# Altium schematic sheet 51.VO-HDMI2.0 TX(DP to HDMI).SchDoc
size 420 x 297 mm; Revision: V2.1; Schematic Page Number: 11; Page Number: 29; Check: Default; Schematic Name: RK_NVR_DEMO1_RK3588_LP4/4x_V21; Page Count: 43; Page name: 51.VO-HDMI2.0 TX(DP to HDMI); Designer: Zhangdz; Schematic Page Count: 99; Revcode: V2.1; DsnPath: E:\Work\SBER\RK3588_SOM\temp\RK_NVR_DEMO1_RK3588_LP4XD200P232SD8_V21_20211228.DSN; SchematicName: RK_NVR_DEMO1_RK3588_LP4/4x_V21; PageName: 51.VO-HDMI2.0 TX(DP to HDMI); PageSize: A3; TopSchematic: True
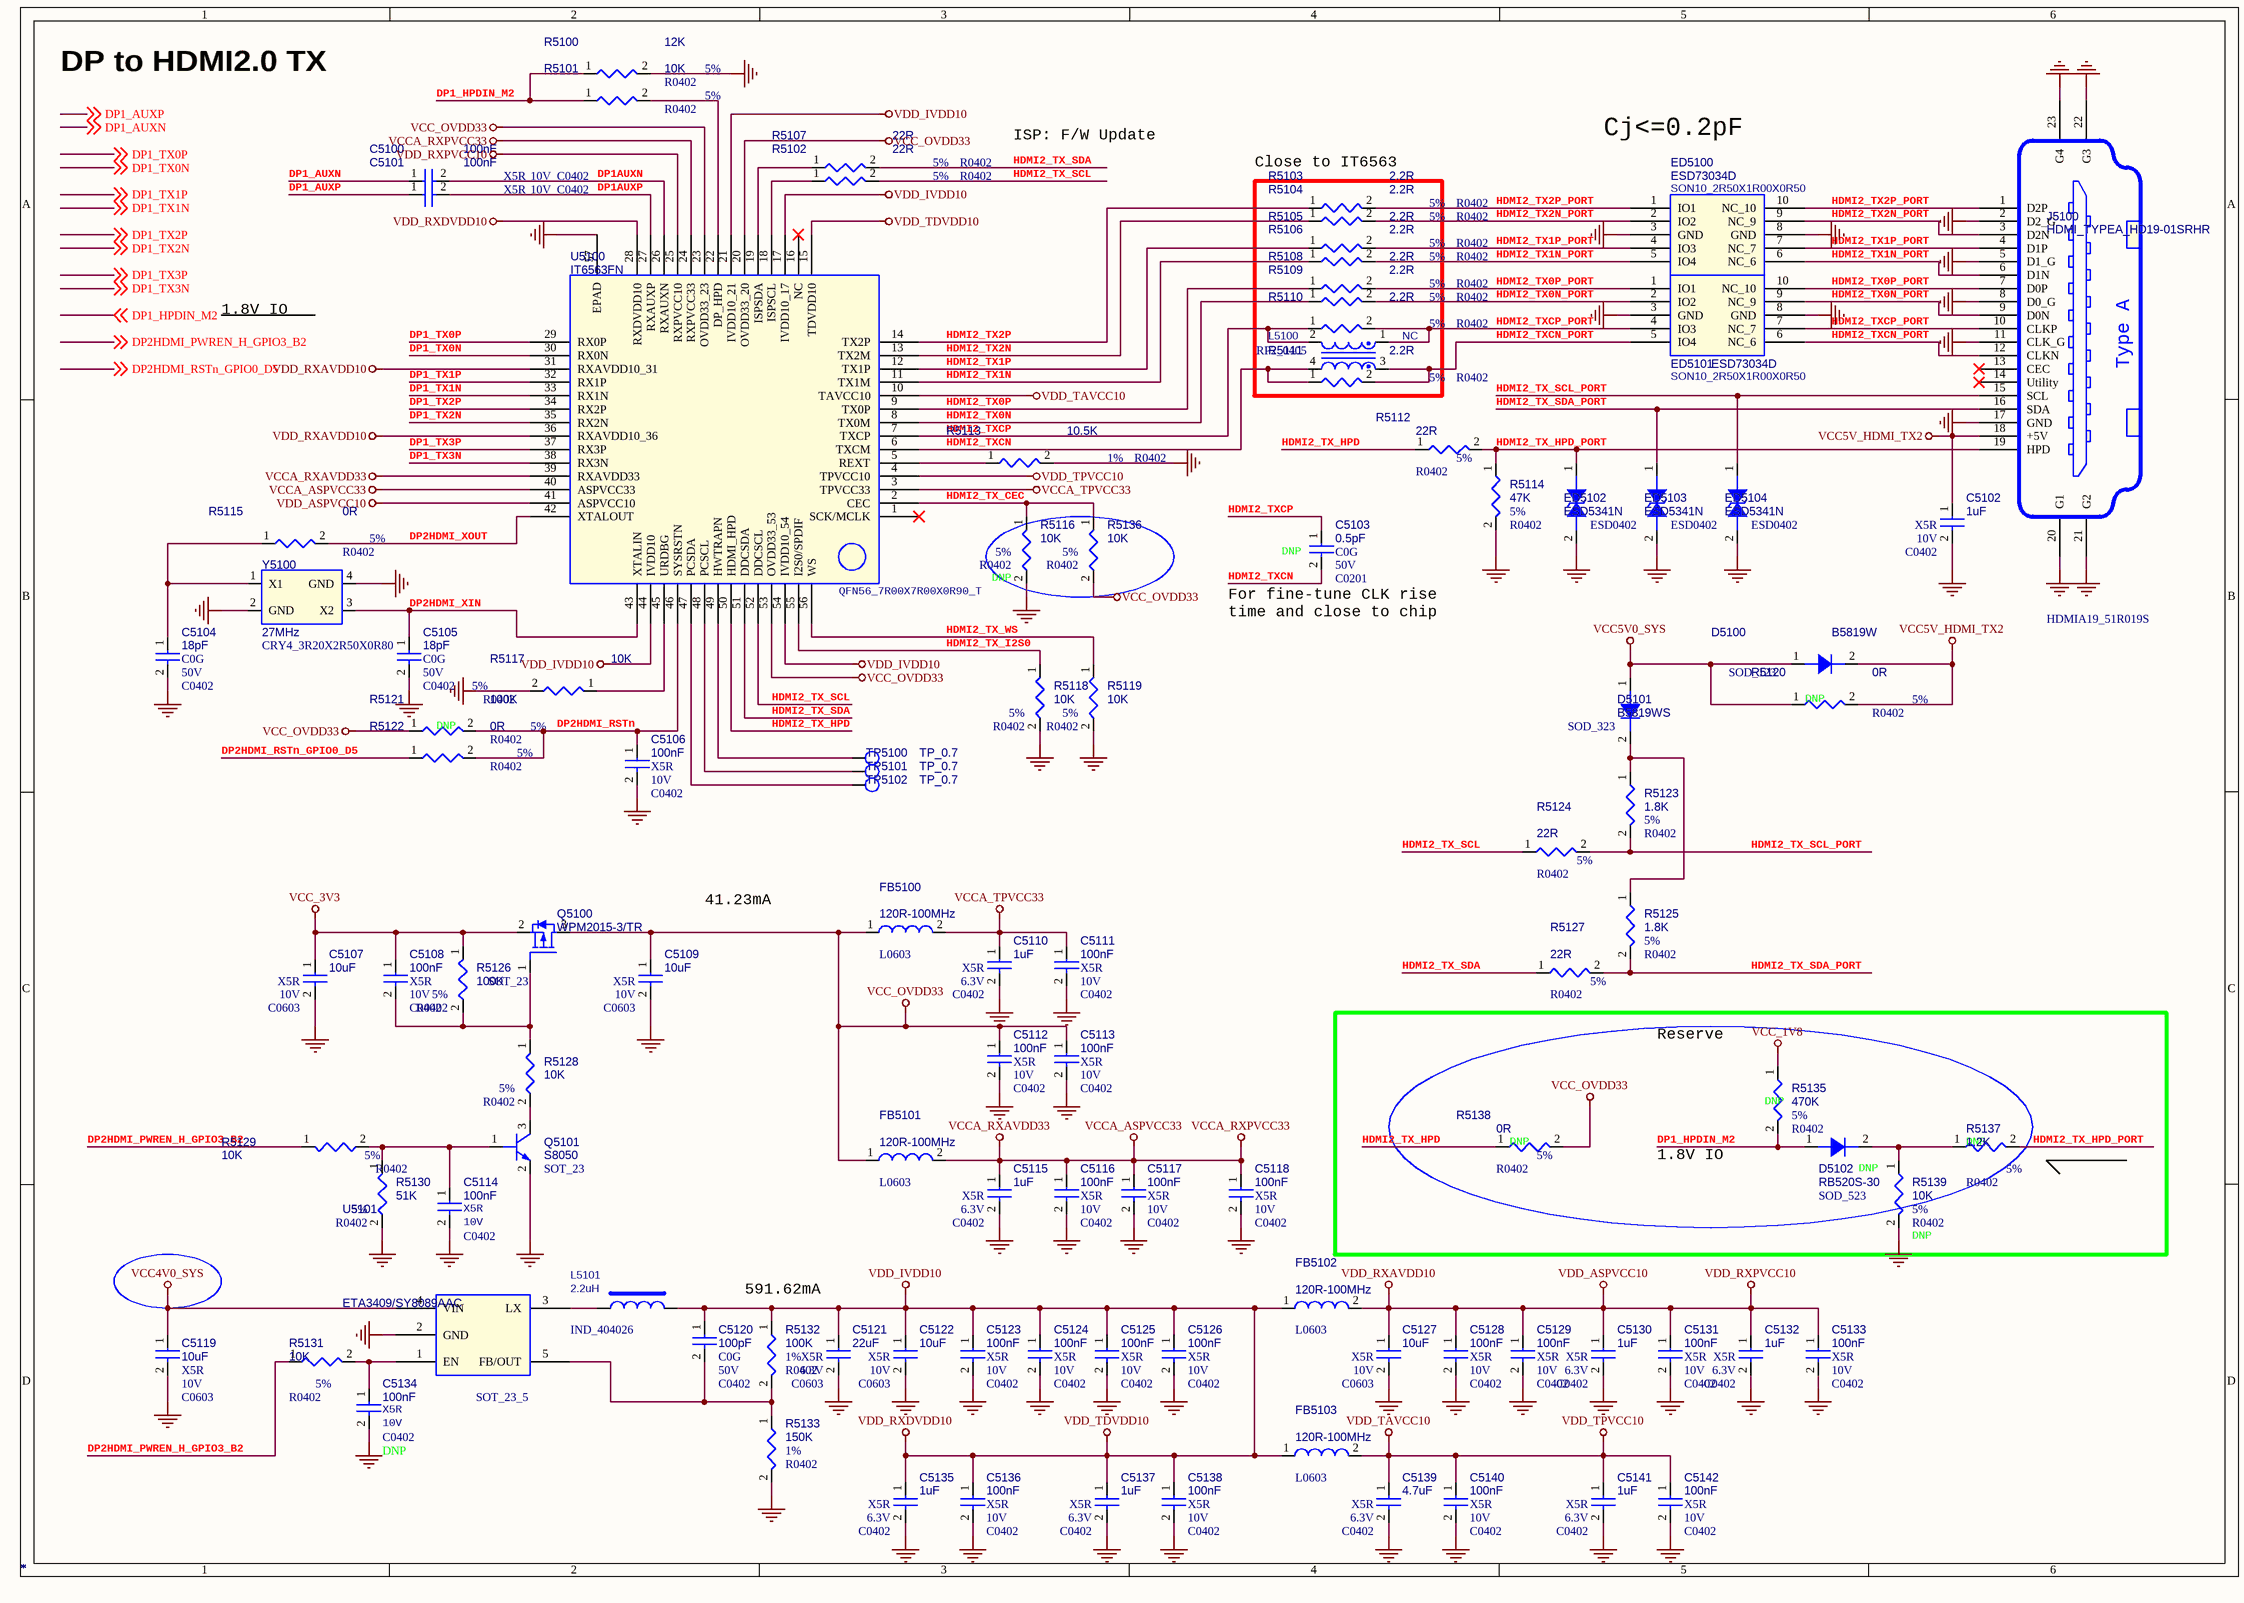
[diagram p0: 51.VO-HDMI2.0 TX(DP to HDMI).SchDoc]

## Parts
C5100  *  Voltage: 10V  Dielectric: X5R  [C0402]
C5101  *  Voltage: 10V  Dielectric: X5R  [C0402]
C5102  *  Voltage: 10V  Dielectric: X5R  [C0402]
C5103  *  Voltage: 50V  Dielectric: C0G  Option: DNP  [C0201]
C5104  *  Voltage: 50V  Dielectric: C0G  [C0402]
C5105  *  Voltage: 50V  Dielectric: C0G  [C0402]
C5106  *  Voltage: 10V  Dielectric: X5R  [C0402]
C5107  *  Voltage: 10V  Dielectric: X5R  [C0603]
C5108  *  Voltage: 10V  Dielectric: X5R  [C0402]
C5109  *  Voltage: 10V  Dielectric: X5R  [C0603]
C5110  *  Voltage: 6.3V  Dielectric: X5R  [C0402]
C5111  *  Voltage: 10V  Dielectric: X5R  [C0402]
C5112  *  Voltage: 10V  Dielectric: X5R  [C0402]
C5113  *  Voltage: 10V  Dielectric: X5R  [C0402]
C5114  *  Voltage: 10V  Dielectric: X5R  [C0402]
C5115  *  Voltage: 6.3V  Dielectric: X5R  [C0402]
C5116  *  Voltage: 10V  Dielectric: X5R  [C0402]
C5117  *  Voltage: 10V  Dielectric: X5R  [C0402]
C5118  *  Voltage: 10V  Dielectric: X5R  [C0402]
C5119  *  Voltage: 10V  Dielectric: X5R  [C0603]
C5120  *  Voltage: 50V  Dielectric: C0G  [C0402]
C5121  *  Voltage: 6.3V  Dielectric: X5R  [C0603]
C5122  *  Voltage: 10V  Dielectric: X5R  [C0603]
C5123  *  Voltage: 10V  Dielectric: X5R  [C0402]
C5124  *  Voltage: 10V  Dielectric: X5R  [C0402]
C5125  *  Voltage: 10V  Dielectric: X5R  [C0402]
C5126  *  Voltage: 10V  Dielectric: X5R  [C0402]
C5127  *  Voltage: 10V  Dielectric: X5R  [C0603]
C5128  *  Voltage: 10V  Dielectric: X5R  [C0402]
C5129  *  Voltage: 10V  Dielectric: X5R  [C0402]
C5130  *  Voltage: 6.3V  Dielectric: X5R  [C0402]
C5131  *  Voltage: 10V  Dielectric: X5R  [C0402]
C5132  *  Voltage: 6.3V  Dielectric: X5R  [C0402]
C5133  *  Voltage: 10V  Dielectric: X5R  [C0402]
C5134  *  Voltage: 10V  Dielectric: X5R  option: DNP  [C0402]
C5135  *  Voltage: 6.3V  Dielectric: X5R  [C0402]
C5136  *  Voltage: 10V  Dielectric: X5R  [C0402]
C5137  *  Voltage: 6.3V  Dielectric: X5R  [C0402]
C5138  *  Voltage: 10V  Dielectric: X5R  [C0402]
C5139  *  Voltage: 6.3V  Dielectric: X5R  [C0402]
C5140  *  Voltage: 10V  Dielectric: X5R  [C0402]
C5141  *  Voltage: 6.3V  Dielectric: X5R  [C0402]
C5142  *  Voltage: 10V  Dielectric: X5R  [C0402]
D5100  *  [SOD_123]
D5101  *  [SOD_323]
D5102  *  Option: DNP  [SOD_523]
ED5100  *  [SON10_2R50X1R00X0R50]
ED5101  *  [SON10_2R50X1R00X0R50]
ED5102  *  [ESD0402]
ED5103  *  [ESD0402]
ED5104  *  [ESD0402]
FB5100  *  [L0603]
FB5101  *  [L0603]
FB5102  *  [L0603]
FB5103  *  [L0603]
J5100  *  [HDMIA19_51R019S]
L5100  *  PCB Footprint: RP2_0405  [L0402D]
L5101  *  [IND_404026]
Q5100  *  PCB Footprint: SOT_23  [SOT23]
Q5101  *  [SOT_23]
R5100  *  Tolerance: 5%  [R0402]
R5101  *  Tolerance: 5%  [R0402]
R5102  *  Tolerance: 5%  [R0402]
R5103  *  Tolerance: 5%  [R0402]
R5104  *  Tolerance: 5%  [R0402]
R5105  *  Tolerance: 5%  [R0402]
R5106  *  Tolerance: 5%  [R0402]
R5107  *  Tolerance: 5%  [R0402]
R5108  *  Tolerance: 5%  [R0402]
R5109  *  Tolerance: 5%  [R0402]
R5110  *  Tolerance: 5%  [R0402]
R5111  *  Tolerance: 5%  [R0402]
R5112  *  Tolerance: 5%  [R0402]
R5113  *  Tolerance: 1%  [R0402]
R5114  *  Tolerance: 5%  [R0402]
R5115  *  Tolerance: 5%  [R0402]
R5116  *  Tolerance: 5%  option: DNP  [R0402]
R5117  *  Tolerance: 5%  [R0402]
R5118  *  Tolerance: 5%  [R0402]
R5119  *  Tolerance: 5%  [R0402]
R5120  *  Tolerance: 5%  Option: DNP  [R0402]
R5121  *  Tolerance: 5%  Option: DNP  [R0402]
R5122  *  Tolerance: 5%  [R0402]
R5123  *  Tolerance: 5%  [R0402]
R5124  *  Tolerance: 5%  [R0402]
R5125  *  Tolerance: 5%  [R0402]
R5126  *  Tolerance: 5%  [R0402]
R5127  *  Tolerance: 5%  [R0402]
R5128  *  Tolerance: 5%  [R0402]
R5129  *  Tolerance: 5%  [R0402]
R5130  *  Tolerance: 5%  [R0402]
R5131  *  Tolerance: 5%  [R0402]
R5132  *  Tolerance: 1%  [R0402]
R5133  *  Tolerance: 1%  [R0402]
R5135  *  Tolerance: 5%  Option: DNP  [R0402]
R5136  *  Tolerance: 5%  [R0402]
R5137  *  Tolerance: 5%  Option: DNP  [R0402]
R5138  *  Tolerance: 5%  Option: DNP  [R0402]
R5139  *  Tolerance: 5%  Option: DNP  [R0402]
TP5100  *  [TEST]
TP5101  *  [TEST]
TP5102  *  [TEST]
U5100  *  PCB Footprint: QFN56_7R00X7R00X0R90_T  [QFN56_7R00X7R00X]
U5101  *  [SOT_23_5]
Y5100  *  PCB Footprint: CRY4_3R20X2R50X0R80  [CRY-3225]

## Blocks framed on the sheet
Close to IT6563: L5100 R5103-R5106 R5108-R5111

## Nets
GND: C5102.2 C5104.2 C5105.2 C5106.2 C5107.2 C5109.2 C5110.2 C5111.2 C5112.2 C5113.2 C5114.2 C5115.2 C5116.2 C5117.2 C5118.2 C5119.2 C5121.2 C5122.2 C5123.2 C5124.2 C5125.2 C5126.2 C5127.2 C5128.2 C5129.2 C5130.2 C5131.2 C5132.2 C5133.2 C5134.2 C5135.2 C5136.2 C5137.2 C5138.2 C5139.2 C5140.2 C5141.2 C5142.2 ED5100.3(GND) ED5100.8(GND) ED5101.3(GND) ED5101.8(GND) ED5102.2 ED5103.2 ED5104.2 J5100.2(D2_G) J5100.5(D1_G) J5100.8(D0_G) J5100.11(CLK_G) J5100.17(GND) J5100.20(G1) J5100.21(G2) J5100.22(G3) J5100.23(G4) Q5101.2(EMITTER) R5100.2 R5113.2 R5114.2 R5116.2 R5117.2 R5118.2 R5119.2 R5130.2 R5133.2 R5139.2 U5100.57(EPAD) U5101.2(GND) Y5100.2(GND) Y5100.4(GND)
VCC4V0_SYS: C5119.1 U5101.4(VIN)
VCC5V0_SYS: D5100.1(A) D5101.1(A) R5120.1
VCC5V_HDMI_TX2: C5102.1 D5100.2(K) J5100.18(+5V) R5120.2
VCC_1V8: R5135.1
VCC_3V3: C5107.1 C5108.1 Q5100.2(SOURCE) R5126.1
VCC_OVDD33: C5109.1 C5112.1 C5113.1 FB5100.1 FB5101.1 Q5100.3(DRAIN) R5121.1 R5136.2 R5138.2 U5100.20(OVDD33_20) U5100.23(OVDD33_23) U5100.53(OVDD33_53)
VCCA_ASPVCC33: C5115.1 C5116.1 C5117.1 C5118.1 FB5101.2 U5100.24(RXPVCC33) U5100.39(RXAVDD33) U5100.40(ASPVCC33)  [also labelled VCCA_RXAVDD33, VCCA_RXPVCC33]
VCCA_TPVCC33: C5110.1 C5111.1 FB5100.2 U5100.3(TPVCC33)
VDD_ASPVCC10: C5127.1 C5128.1 C5129.1 C5130.1 C5131.1 C5132.1 C5133.1 FB5102.2 U5100.25(RXPVCC10) U5100.31(RXAVDD10_31) U5100.36(RXAVDD10_36) U5100.41(ASPVCC10)  [also labelled VDD_RXAVDD10, VDD_RXPVCC10]
VDD_IVDD10: C5120.1 C5121.1 C5122.1 C5123.1 C5124.1 C5125.1 C5126.1 C5135.1 C5136.1 C5137.1 C5138.1 FB5102.1 FB5103.1 L5101.2 R5132.1 U5100.15(TDVDD10) U5100.17(IVDD10_17) U5100.21(IVDD10_21) U5100.28(RXDVDD10) U5100.44(IVDD10) U5100.54(IVDD10_54)  [also labelled VDD_RXDVDD10, VDD_TDVDD10]
VDD_TAVCC10: C5139.1 C5140.1 C5141.1 C5142.1 FB5103.2 U5100.4(TPVCC10) U5100.10(TAVCC10)  [also labelled VDD_TPVCC10]
DP1_AUXN: C5100.1 ; off-sheet DP1_AUXN
DP1_AUXP: C5101.1 ; off-sheet DP1_AUXP
DP1_HPDIN_M2: D5102.1(A) R5100.1 R5101.1 R5135.2 ; off-sheet DP1_HPDIN_M2
DP1_TX0N: U5100.30(RX0N) ; off-sheet DP1_TX0N
DP1_TX0P: U5100.29(RX0P) ; off-sheet DP1_TX0P
DP1_TX1N: U5100.33(RX1N) ; off-sheet DP1_TX1N
DP1_TX1P: U5100.32(RX1P) ; off-sheet DP1_TX1P
DP1_TX2N: U5100.35(RX2N) ; off-sheet DP1_TX2N
DP1_TX2P: U5100.34(RX2P) ; off-sheet DP1_TX2P
DP1_TX3N: U5100.38(RX3N) ; off-sheet DP1_TX3N
DP1_TX3P: U5100.37(RX3P) ; off-sheet DP1_TX3P
DP1AUXN: C5100.2 U5100.26(RXAUXN)
DP1AUXP: C5101.2 U5100.27(RXAUXP)
DP2HDMI_PWREN_H_GPIO3_B2: R5129.1 R5131.1 ; off-sheet DP2HDMI_PWREN_H_GPIO3_B2
DP2HDMI_RSTn: C5106.1 R5121.2 R5122.2 U5100.46(SYSRSTN)
DP2HDMI_RSTn_GPIO0_D5: R5122.1 ; off-sheet DP2HDMI_RSTn_GPIO0_D5
DP2HDMI_XIN: C5105.1 U5100.43(XTALIN) Y5100.3(X2)
DP2HDMI_XOUT: R5115.2 U5100.42(XTALOUT)
HDMI2_TX0N: R5109.1 U5100.8(TX0M)
HDMI2_TX0N_PORT: ED5101.2(IO2) ED5101.9(NC_9) J5100.9(D0N) R5109.2
HDMI2_TX0P: R5108.1 U5100.9(TX0P)
HDMI2_TX0P_PORT: ED5101.1(IO1) ED5101.10(NC_10) J5100.7(D0P) R5108.2
HDMI2_TX1N: R5106.1 U5100.11(TX1M)
HDMI2_TX1N_PORT: ED5100.5(IO4) ED5100.6(NC_6) J5100.6(D1N) R5106.2
HDMI2_TX1P: R5105.1 U5100.12(TX1P)
HDMI2_TX1P_PORT: ED5100.4(IO3) ED5100.7(NC_7) J5100.4(D1P) R5105.2
HDMI2_TX2N: R5104.1 U5100.13(TX2M)
HDMI2_TX2N_PORT: ED5100.2(IO2) ED5100.9(NC_9) J5100.3(D2N) R5104.2
HDMI2_TX2P: R5103.1 U5100.14(TX2P)
HDMI2_TX2P_PORT: ED5100.1(IO1) ED5100.10(NC_10) J5100.1(D2P) R5103.2
HDMI2_TX_CEC: R5116.1 R5136.1 U5100.2(CEC)
HDMI2_TX_HPD: R5112.1 R5138.1 U5100.50(HDMI_HPD)
HDMI2_TX_HPD_PORT: ED5102.1 J5100.19(HPD) R5112.2 R5114.1 R5137.2
HDMI2_TX_I2S0: R5118.1 U5100.55(I2S0/SPDIF)
HDMI2_TX_SCL: R5102.2 R5124.1 U5100.52(DDCSCL)
HDMI2_TX_SCL_PORT: ED5104.1 J5100.15(SCL) R5123.2 R5124.2
HDMI2_TX_SDA: R5107.2 R5127.1 U5100.51(DDCSDA)
HDMI2_TX_SDA_PORT: ED5103.1 J5100.16(SDA) R5125.2 R5127.2
HDMI2_TX_WS: R5119.1 U5100.56(WS)
HDMI2_TXCN: C5103.2 L5100.4 R5111.1 U5100.6(TXCM)
HDMI2_TXCN_PORT: ED5101.5(IO4) ED5101.6(NC_6) J5100.12(CLKN) L5100.3 R5111.2
HDMI2_TXCP: C5103.1 L5100.2 R5110.1 U5100.7(TXCP)
HDMI2_TXCP_PORT: ED5101.4(IO3) ED5101.7(NC_7) J5100.10(CLKP) L5100.1 R5110.2
NetC5104_1: C5104.1 R5115.1 Y5100.1(X1)
NetC5108_2: C5108.2 Q5100.1(GATE) R5126.2 R5128.1
NetC5114_1: C5114.1 Q5101.1(BASE) R5129.2 R5130.1
NetC5120_2: C5120.2 R5132.2 R5133.1 U5101.5(FB/OUT)
NetC5134_1: C5134.1 R5131.2 U5101.1(EN)
NetD5101_2: D5101.2(K) R5123.1 R5125.1
NetD5102_2: D5102.2(K) R5137.1 R5139.1
NetL5101_1: L5101.1 U5101.3(LX)
NetQ5101_3: Q5101.3(COLLECTOR) R5128.2
NetR5101_2: R5101.2 U5100.22(DP_HPD)
NetR5102_1: R5102.1 U5100.18(ISPSCL)
NetR5107_1: R5107.1 U5100.19(ISPSDA)
NetR5113_1: R5113.1 U5100.5(REXT)
NetR5117_1: R5117.1 U5100.45(URDBG)
NetTP5100_1: TP5100.1 U5100.49(HWTRAPN)
NetTP5101_1: TP5101.1 U5100.48(PCSCL)
NetTP5102_1: TP5102.1 U5100.47(PCSDA)

Not connected (* = marked no-connect by the designer): J5100 13(CEC)* 14(Utility)*; U5100 1(SCK/MCLK)* 16(NC)*

## Notes on the sheet
- DP to HDMI2.0 TX
- ISP: F/W Update
- Cj<=0.2pF
- 1.8V IO
- (near C5103) For fine-tune CLK rise
  time and close to chip
- 41.23mA
- Reserve
- 591.62mA
- (in symbol HDMI_TYPE_A_0) Type A

## Library data of the parts
C5100 = CAP NP: cap,100.00nF,+/-10%,10V,X5R,C0402; Part Reference: C5100; Manufacturer: TDK; Value: 100nF; RK PN: C1005X5R1A104K050BA; Priority: A; Tolerance: 10%; PCB Footprint: C0402; Part Type: C0402; Manufacturer PN: C1005X5R1A104K050BA; Created by: JJJ
C5101 = CAP NP: cap,100.00nF,+/-10%,10V,X5R,C0402; Part Reference: C5101; Manufacturer PN: C1005X5R1A104K050BA; Manufacturer: TDK; Value: 100nF; Tolerance: 10%; Priority: A; PCB Footprint: C0402; Created by: JJJ; Part Type: C0402; RK PN: C1005X5R1A104K050BA
C5102 = CAP NP: cap,1.00uF,+/-10%,10V,X5R,C0402; Part Reference: C5102; Manufacturer PN: C1005X5R1A105K050BB; Manufacturer: TDK; Value: 1uF; Tolerance: 10%; Priority: A; Number: 37; PCB Footprint: C0402; Created by: JJJ; C_Voltage: 10V; Part Type: C0402; RK PN: C1005X5R1A105K050BB
C5103 = CAP NP: cap,0.50pF,+/-0.25,50V,C0G,C0201; Part Reference: C5103; Manufacturer: TDK; Value: 0.5pF; RK PN: C0603C0G1H0R5C030BA; Priority: A; Tolerance: +/-0.25pF; PCB Footprint: C0201; Part Type: C0201; Manufacturer PN: C0603C0G1H0R5C030BA; Created by: JJJ
C5104 = CAP NP: cap,18.00pF,+/-5%,50V,C0G,C0402; Part Reference: C5104; Manufacturer PN: C1005C0G1H180J050BA; Manufacturer: TDK; Value: 18pF; Tolerance: 5%; Priority: A; PCB Footprint: C0402; Created by: JJJ; Part Type: C0402; RK PN: C1005C0G1H180J050BA
C5105 = CAP NP: cap,18.00pF,+/-5%,50V,C0G,C0402; Part Reference: C5105; Manufacturer PN: C1005C0G1H180J050BA; Manufacturer: TDK; Value: 18pF; Tolerance: 5%; Priority: A; PCB Footprint: C0402; Created by: JJJ; Part Type: C0402; RK PN: C1005C0G1H180J050BA
C5106 = CAP NP: cap,100.00nF,+/-10%,10V,X5R,C0402; Part Reference: C5106; Manufacturer PN: C1005X5R1A104K050BA; Manufacturer: TDK; Value: 100nF; Tolerance: 10%; Priority: A; PCB Footprint: C0402; Created by: JJJ; Part Type: C0402; RK PN: C1005X5R1A104K050BA
C5107 = CAP NP: cap,10.00uF,+/-10%,10V,X5R,C0603; Part Reference: C5107; Manufacturer PN: C1608X5R1A106K080AC; Manufacturer: TDK; Value: 10uF; Tolerance: 10%; C_Voltage: 6.3V; Priority: A; PCB Footprint: C0603; Created by: JJJ; Part Type: C0603; RK PN: C1608X5R1A106K080AC
C5108 = CAP NP: cap,100.00nF,+/-10%,10V,X5R,C0402; Part Reference: C5108; Manufacturer: TDK; Value: 100nF; Number: 37; RK PN: C1005X5R1A104K050BA; Priority: A; Tolerance: 10%; C_Voltage: 6.3V; PCB Footprint: C0402; Part Type: C0402; Manufacturer PN: C1005X5R1A104K050BA; Created by: JJJ
C5109 = CAP NP: cap,10.00uF,+/-10%,10V,X5R,C0603; Part Reference: C5109; Manufacturer PN: C1608X5R1A106K080AC; Manufacturer: TDK; Value: 10uF; Tolerance: 10%; C_Voltage: 6.3V; Priority: A; PCB Footprint: C0603; Created by: JJJ; Part Type: C0603; RK PN: C1608X5R1A106K080AC
C5110 = CAP NP: cap,1.00uF,+/-10%,6.3V,X5R,C0402; Part Reference: C5110; Manufacturer: TDK; Value: 1uF; RK PN: C1005X5R0J105K050BB; Priority: A; Tolerance: 10%; PCB Footprint: C0402; Part Type: C0402; C_Voltage: 6.3V; Manufacturer PN: C1005X5R0J105K050BB; Created by: JJJ
C5111 = CAP NP: cap,100.00nF,+/-10%,10V,X5R,C0402; Part Reference: C5111; Manufacturer: TDK; Value: 100nF; RK PN: C1005X5R1A104K050BA; Priority: A; Tolerance: 10%; PCB Footprint: C0402; Part Type: C0402; Manufacturer PN: C1005X5R1A104K050BA; Created by: JJJ
C5112 = CAP NP: cap,100.00nF,+/-10%,10V,X5R,C0402; Part Reference: C5112; Manufacturer PN: C1005X5R1A104K050BA; Manufacturer: TDK; Value: 100nF; Tolerance: 10%; Priority: A; PCB Footprint: C0402; Created by: JJJ; Part Type: C0402; RK PN: C1005X5R1A104K050BA
C5113 = CAP NP: cap,100.00nF,+/-10%,10V,X5R,C0402; Part Reference: C5113; Manufacturer PN: C1005X5R1A104K050BA; Manufacturer: TDK; Value: 100nF; Tolerance: 10%; Priority: A; PCB Footprint: C0402; Created by: JJJ; Part Type: C0402; RK PN: C1005X5R1A104K050BA
C5114 = CAP NP: cap,100.00nF,+/-10%,10V,X5R,C0402; Part Reference: C5114; Manufacturer PN: C1005X5R1A104K050BA; Manufacturer: TDK; Value: 100nF; Priority: A; Tolerance: 10%; PCB Footprint: C0402; Created by: JJJ; Part Type: C0402; RK PN: C1005X5R1A104K050BA
C5115 = CAP NP: cap,1.00uF,+/-10%,6.3V,X5R,C0402; Part Reference: C5115; Manufacturer: TDK; Value: 1uF; RK PN: C1005X5R0J105K050BB; Priority: A; Tolerance: 10%; PCB Footprint: C0402; Part Type: C0402; C_Voltage: 6.3V; Manufacturer PN: C1005X5R0J105K050BB; Created by: JJJ
C5116 = CAP NP: cap,100.00nF,+/-10%,10V,X5R,C0402; Part Reference: C5116; Manufacturer: TDK; Value: 100nF; RK PN: C1005X5R1A104K050BA; Priority: A; Tolerance: 10%; PCB Footprint: C0402; Part Type: C0402; Manufacturer PN: C1005X5R1A104K050BA; Created by: JJJ
C5117 = CAP NP: cap,100.00nF,+/-10%,10V,X5R,C0402; Part Reference: C5117; Manufacturer PN: C1005X5R1A104K050BA; Manufacturer: TDK; Value: 100nF; Tolerance: 10%; Priority: A; PCB Footprint: C0402; Created by: JJJ; Part Type: C0402; RK PN: C1005X5R1A104K050BA
C5118 = CAP NP: cap,100.00nF,+/-10%,10V,X5R,C0402; Part Reference: C5118; Manufacturer PN: C1005X5R1A104K050BA; Manufacturer: TDK; Value: 100nF; Tolerance: 10%; Priority: A; PCB Footprint: C0402; Created by: JJJ; Part Type: C0402; RK PN: C1005X5R1A104K050BA
C5119 = CAP NP: cap,10.00uF,+/-10%,10V,X5R,C0603; Part Reference: C5119; Manufacturer: TDK; Value: 10uF; RK PN: C1608X5R1A106K080AC; Priority: A; Tolerance: 10%; PCB Footprint: C0603; Part Type: C0603; Manufacturer PN: C1608X5R1A106K080AC; Created by: JJJ
C5120 = CAP NP: cap,100.00pF,+/-10%,50V,C0G,C0402; Part Reference: C5120; Manufacturer: TDK; Value: 100pF; RK PN: C1005C0G1H101K050BA; Priority: A; Tolerance: 10%; PCB Footprint: C0402; Part Type: C0402; Manufacturer PN: C1005C0G1H101K050BA; Created by: JJJ
C5121 = CAP NP: cap,22.00uF,+/-20%,6.3V,X5R,C0603; Part Reference: C5121; Manufacturer: TDK; Value: 22uF; RK PN: C1608X5R0J226M080AC; Priority: A; Tolerance: 20%; PCB Footprint: C0603; Part Type: C0603; C_Voltage: 6.3V; Manufacturer PN: C1608X5R0J226M080AC; Created by: JJJ
C5122 = CAP NP: cap,10.00uF,+/-10%,10V,X5R,C0603; Part Reference: C5122; Manufacturer PN: C1608X5R1A106K080AC; Manufacturer: TDK; Value: 10uF; Tolerance: 10%; C_Voltage: 6.3V; Priority: A; PCB Footprint: C0603; Created by: JJJ; Part Type: C0603; RK PN: C1608X5R1A106K080AC
C5123 = CAP NP: cap,100.00nF,+/-10%,10V,X5R,C0402; Part Reference: C5123; Manufacturer PN: C1005X5R1A104K050BA; Manufacturer: TDK; Value: 100nF; Tolerance: 10%; Priority: A; PCB Footprint: C0402; Created by: JJJ; Part Type: C0402; RK PN: C1005X5R1A104K050BA
C5124 = CAP NP: cap,100.00nF,+/-10%,10V,X5R,C0402; Part Reference: C5124; Manufacturer PN: C1005X5R1A104K050BA; Manufacturer: TDK; Value: 100nF; Tolerance: 10%; Priority: A; PCB Footprint: C0402; Created by: JJJ; Part Type: C0402; RK PN: C1005X5R1A104K050BA
C5125 = CAP NP: cap,100.00nF,+/-10%,10V,X5R,C0402; Part Reference: C5125; Manufacturer: TDK; Value: 100nF; RK PN: C1005X5R1A104K050BA; Priority: A; Tolerance: 10%; PCB Footprint: C0402; Part Type: C0402; Manufacturer PN: C1005X5R1A104K050BA; Created by: JJJ
C5126 = CAP NP: cap,100.00nF,+/-10%,10V,X5R,C0402; Part Reference: C5126; Manufacturer PN: C1005X5R1A104K050BA; Manufacturer: TDK; Value: 100nF; Tolerance: 10%; Priority: A; PCB Footprint: C0402; Created by: JJJ; Part Type: C0402; RK PN: C1005X5R1A104K050BA
C5127 = CAP NP: cap,10.00uF,+/-10%,10V,X5R,C0603; Part Reference: C5127; Manufacturer PN: C1608X5R1A106K080AC; Manufacturer: TDK; Value: 10uF; Tolerance: 10%; C_Voltage: 6.3V; Priority: A; PCB Footprint: C0603; Created by: JJJ; Part Type: C0603; RK PN: C1608X5R1A106K080AC
C5128 = CAP NP: cap,100.00nF,+/-10%,10V,X5R,C0402; Part Reference: C5128; Manufacturer: TDK; Value: 100nF; RK PN: C1005X5R1A104K050BA; Priority: A; Tolerance: 10%; PCB Footprint: C0402; Part Type: C0402; Manufacturer PN: C1005X5R1A104K050BA; Created by: JJJ
C5129 = CAP NP: cap,100.00nF,+/-10%,10V,X5R,C0402; Part Reference: C5129; Manufacturer PN: C1005X5R1A104K050BA; Manufacturer: TDK; Value: 100nF; Tolerance: 10%; Priority: A; PCB Footprint: C0402; Created by: JJJ; Part Type: C0402; RK PN: C1005X5R1A104K050BA
C5130 = CAP NP: cap,1.00uF,+/-10%,6.3V,X5R,C0402; Part Reference: C5130; Manufacturer: TDK; Value: 1uF; RK PN: C1005X5R0J105K050BB; Priority: A; Tolerance: 10%; PCB Footprint: C0402; Part Type: C0402; C_Voltage: 6.3V; Manufacturer PN: C1005X5R0J105K050BB; Created by: JJJ
C5131 = CAP NP: cap,100.00nF,+/-10%,10V,X5R,C0402; Part Reference: C5131; Manufacturer: TDK; Value: 100nF; RK PN: C1005X5R1A104K050BA; Priority: A; Tolerance: 10%; PCB Footprint: C0402; Part Type: C0402; Manufacturer PN: C1005X5R1A104K050BA; Created by: JJJ
C5132 = CAP NP: cap,1.00uF,+/-10%,6.3V,X5R,C0402; Part Reference: C5132; Manufacturer: TDK; Value: 1uF; RK PN: C1005X5R0J105K050BB; Priority: A; Tolerance: 10%; PCB Footprint: C0402; Part Type: C0402; C_Voltage: 6.3V; Manufacturer PN: C1005X5R0J105K050BB; Created by: JJJ
C5133 = CAP NP: cap,100.00nF,+/-10%,10V,X5R,C0402; Part Reference: C5133; Manufacturer: TDK; Value: 100nF; RK PN: C1005X5R1A104K050BA; Priority: A; Tolerance: 10%; PCB Footprint: C0402; Part Type: C0402; Manufacturer PN: C1005X5R1A104K050BA; Created by: JJJ
C5134 = CAP NP: cap,100.00nF,+/-10%,10V,X5R,C0402; Part Reference: C5134; Manufacturer PN: C1005X5R1A104K050BA; Manufacturer: TDK; Value: 100nF; Priority: A; Tolerance: 10%; PCB Footprint: C0402; Created by: JJJ; Part Type: C0402; RK PN: C1005X5R1A104K050BA
C5135 = CAP NP: cap,1.00uF,+/-10%,6.3V,X5R,C0402; Part Reference: C5135; Manufacturer PN: C1005X5R0J105K050BB; Manufacturer: TDK; Value: 1uF; Tolerance: 10%; Priority: A; PCB Footprint: C0402; Created by: JJJ; C_Voltage: 6.3V; Part Type: C0402; RK PN: C1005X5R0J105K050BB
C5136 = CAP NP: cap,100.00nF,+/-10%,10V,X5R,C0402; Part Reference: C5136; Manufacturer PN: C1005X5R1A104K050BA; Manufacturer: TDK; Value: 100nF; Tolerance: 10%; Priority: A; PCB Footprint: C0402; Created by: JJJ; Part Type: C0402; RK PN: C1005X5R1A104K050BA
C5137 = CAP NP: cap,1.00uF,+/-10%,6.3V,X5R,C0402; Part Reference: C5137; Manufacturer: TDK; Value: 1uF; RK PN: C1005X5R0J105K050BB; Priority: A; Tolerance: 10%; PCB Footprint: C0402; Part Type: C0402; C_Voltage: 6.3V; Manufacturer PN: C1005X5R0J105K050BB; Created by: JJJ
C5138 = CAP NP: cap,100.00nF,+/-10%,10V,X5R,C0402; Part Reference: C5138; Manufacturer: TDK; Value: 100nF; RK PN: C1005X5R1A104K050BA; Priority: A; Tolerance: 10%; PCB Footprint: C0402; Part Type: C0402; Manufacturer PN: C1005X5R1A104K050BA; Created by: JJJ
C5139 = CAP NP: cap,4.70uF,+/-10%,6.3V,X5R,C0402; Part Reference: C5139; Manufacturer: TDK; Value: 4.7uF; RK PN: C1005X5R0J475K050BC; Priority: A; Tolerance: 10%; PCB Footprint: C0402; Part Type: C0402; C_Voltage: 6.3V; Manufacturer PN: C1005X5R0J475K050BC; Created by: JJJ
C5140 = CAP NP: cap,100.00nF,+/-10%,10V,X5R,C0402; Part Reference: C5140; Manufacturer: TDK; Value: 100nF; RK PN: C1005X5R1A104K050BA; Priority: A; Tolerance: 10%; PCB Footprint: C0402; Part Type: C0402; Manufacturer PN: C1005X5R1A104K050BA; Created by: JJJ
C5141 = CAP NP: cap,1.00uF,+/-10%,6.3V,X5R,C0402; Part Reference: C5141; Manufacturer: TDK; Value: 1uF; RK PN: C1005X5R0J105K050BB; Priority: A; Tolerance: 10%; PCB Footprint: C0402; Part Type: C0402; C_Voltage: 6.3V; Manufacturer PN: C1005X5R0J105K050BB; Created by: JJJ
C5142 = CAP NP: cap,100.00nF,+/-10%,10V,X5R,C0402; Part Reference: C5142; Manufacturer: TDK; Value: 100nF; RK PN: C1005X5R1A104K050BA; Priority: A; Tolerance: 10%; PCB Footprint: C0402; Part Type: C0402; Manufacturer PN: C1005X5R1A104K050BA; Created by: JJJ
D5100 = DIODE: Schottky BarrierЈ¬B5819W SOD-123; Part Reference: D5100; Manufacturer: і¤µз; Value: B5819W; Priority: A; PCB Footprint: SOD_123; Created by: JJJ; Manufacturer PN: B5819W; Part Type: Schottky rectifier; RK PN: B5819W
D5101 = DIODE: Schottky BarrierЈ¬B5819WS SOD-323; Part Reference: D5101; Manufacturer: і¤µз; Priority: A; PCB Footprint: SOD_323; Value: B5819WS; RK PN: B5819WS; Part Type: Schottky rectifier; Manufacturer PN: B5819WS; Created by: JJJ
D5102 = DIODE: Schottky barrier Diode; Part Reference: D5102; Manufacturer: і¤µз; Value: RB520S-30; Priority: A; If: 1A; Vrms: 30V; Vf: 0.6V; PCB Footprint: SOD_523; RK PN: RB520S-30; Part Type: Schottky rectifier; Manufacturer PN: RB520S-30; Created by: JJJ
ED5100 = ESD_ESD5304D: 4-Lines, Uni-directional, Ultra-low Capacitance Transient Voltage Suppressors; Part Reference: ED5100; Manufacturer: WillSemi(О¤¶ы°лµјМе); Value: ESD73034D; Priority: A; PCB Footprint: SON10_2R50X1R00X0R50; Created by: JJJ; Manufacturer PN: ESD5304D; Part Type: ESD_TVS; RK PN: ESD5304D
ED5101 = ESD_ESD5304D: 4-Lines, Uni-directional, Ultra-low Capacitance Transient Voltage Suppressors; Part Reference: ED5101; Manufacturer: WillSemi(О¤¶ы°лµјМе); Value: ESD73034D; Priority: A; PCB Footprint: SON10_2R50X1R00X0R50; RK PN: ESD5304D; Part Type: ESD_TVS; Manufacturer PN: ESD5304D; Created by: JJJ
ED5102 = DIODE BI_DIR TRIG: 1-Line, Bi-directional, Transient Voltage Suppressors.1pF.; Part Reference: ED5102; Manufacturer: WillSemi(О¤¶ы°лµјМе); Value: ESD5341N; Priority: A; PCB Footprint: ESD0402; Created by: JJJ; Manufacturer PN: ESD5341N; Part Type: ESD_TVS; RK PN: ESD5341N
ED5103 = DIODE BI_DIR TRIG: 1-Line, Bi-directional, Transient Voltage Suppressors.1pF.; Part Reference: ED5103; Manufacturer: WillSemi(О¤¶ы°лµјМе); Value: ESD5341N; Priority: A; PCB Footprint: ESD0402; RK PN: ESD5341N; Part Type: ESD_TVS; Manufacturer PN: ESD5341N; Created by: JJJ
ED5104 = DIODE BI_DIR TRIG: 1-Line, Bi-directional, Transient Voltage Suppressors.1pF.; Part Reference: ED5104; Manufacturer: WillSemi(О¤¶ы°лµјМе); Value: ESD5341N; Priority: A; PCB Footprint: ESD0402; RK PN: ESD5341N; Part Type: ESD_TVS; Manufacturer PN: ESD5341N; Created by: JJJ
FB5100 = BEAD: BEAD,120R@100MHz,current=2000mA,0603; Part Reference: FB5100; Manufacturer: Murata; DC Resistor: 0.030ohm; Tolerance: 25%; Irms: 2A; Value: 120R-100MHz; RK PN: BLM18KG121TN1; Priority: L; PCB Footprint: L0603; Part Type: BEAD; Manufacturer PN: BLM18KG121TN1; Created by: DZS
FB5101 = BEAD: BEAD,120R@100MHz,current=2000mA,0603; Part Reference: FB5101; Manufacturer: Murata; DC Resistor: 0.030ohm; Tolerance: 25%; Irms: 2A; Value: 120R-100MHz; RK PN: BLM18KG121TN1; Priority: L; PCB Footprint: L0603; Part Type: BEAD; Manufacturer PN: BLM18KG121TN1; Created by: DZS
FB5102 = BEAD: BEAD,120R@100MHz,current=2000mA,0603; Part Reference: FB5102; Manufacturer: Murata; DC Resistor: 0.030ohm; Tolerance: 25%; Irms: 2A; Value: 120R-100MHz; RK PN: BLM18KG121TN1; Priority: L; PCB Footprint: L0603; Part Type: BEAD; Manufacturer PN: BLM18KG121TN1; Created by: DZS
FB5103 = BEAD: BEAD,120R@100MHz,current=2000mA,0603; Part Reference: FB5103; Manufacturer PN: BLM18KG121TN1; Manufacturer: Murata; DC Resistor: 0.030ohm; Tolerance: 25%; Irms: 2A; Value: 120R-100MHz; Priority: L; PCB Footprint: L0603; Created by: DZS; Part Type: BEAD; RK PN: BLM18KG121TN1
J5100 = HDMI_TYPE_A_0: Part Reference: J5100; Value: HDMI_TYPEA_HD19-01SRHR; PCB Footprint: HDMIA19_51R019S
L5100 = INDUCTOR COM: Winding Type Common Mode Choke Coil; Part Reference: L5100; Manufacturer: sunlord; Value: NC; RK PN: SDCW2012-2-900TF; Priority: A; DC Resistor: 0.35ohm; Tolerance: 25%; Irms: 330mA; Resonace frequency: 90R@100M; Part Type: IND; Manufacturer PN: SDCW2012-2-900TF; Created by: JJJ
L5101 = INDUCTORS OF FERRITE_Dup1: Power Inductor,2.2uH,0.2,IND_404026; Part Reference: L5101; Manufacturer PN: SWPA4026S2R2MT; Manufacturer: sunlord; Isat: 2.10A; DC Resistor: 0.04ohm; Resonace frequency: 96M; Irms: 2A; Tolerance: 20%; Priority: A; PCB Footprint: IND_404026; Value: 2.2uH; Created by: YTL; Part Type: POWER_IND; RK PN: SWPA4026S2R2MT
Q5100 = MOSFET P: PMOS,WPM2015-3/TR,SOT_23,Id=2.4A,Vds=20V; Part Reference: Q5100; Manufacturer: WillSemi(О¤¶ы°лµјМе); Priority: A; Id_max: 2.4A; Vgs: ЎА8V; VDS: 20V; Vgsth: 0.62V; Pd: 0.5W; Value: WPM2015-3/TR; RK PN: WPM2015-3/TR; Part Type: PMOS; Manufacturer PN: WPM2015-3/TR; Created by: JJJ
Q5101 = NPN: S8050,SOT23; Part Reference: Q5101; Manufacturer PN: S8050_SOT23; Manufacturer: і¤µз; Pc: 0.3W; Vceo: 25V; Ic: 0.5A; Priority: A; PCB Footprint: SOT_23; Value: S8050; Created by: JJJ; Part Type: NPN; RK PN: S8050
R5100 = RESISTOR_Dup1: НЁУГєсД¤µзЧи,12K,+/-5%,R0402,1/16W.; Part Reference: R5100; Manufacturer PN: RC0402JR-0712KL; Manufacturer: YAGEO; Wattage: 1/16W; Priority: A; PCB Footprint: R0402; Value: 12K; Created by: YTL; Part Type: НЁУГєсД¤µзЧи; RK PN: RC0402JR-0712KL
R5101 = RESISTOR_Dup1: НЁУГєсД¤µзЧи,10K,+/-5%,R0402,1/16W.; Part Reference: R5101; Manufacturer PN: RC0402JR-0710KL; Manufacturer: YAGEO; Wattage: 1/16W; Priority: A; PCB Footprint: R0402; Value: 10K; Created by: YTL; Part Type: НЁУГєсД¤µзЧи; RK PN: RC0402JR-0710KL
R5102 = RESISTOR_Dup1: НЁУГєсД¤µзЧи,22R,+/-5%,R0402,1/16W.; Part Reference: R5102; Manufacturer PN: RC0402JR-0722RL; Manufacturer: YAGEO; Wattage: 1/16W; Priority: A; PCB Footprint: R0402; Value: 22R; Created by: YTL; Part Type: НЁУГєсД¤µзЧи; RK PN: RC0402JR-0722RL
R5103 = RESISTOR_Dup1: НЁУГєсД¤µзЧи,2R2,+/-5%,R0402,1/16W.; Part Reference: R5103; Manufacturer: YAGEO; Value: 2.2R; RK PN: RC0402JR-072R2L; Priority: A; Wattage: 1/16W; PCB Footprint: R0402; Part Type: НЁУГєсД¤µзЧи; Manufacturer PN: RC0402JR-072R2L; Created by: YTL
R5104 = RESISTOR_Dup1: НЁУГєсД¤µзЧи,2R2,+/-5%,R0402,1/16W.; Part Reference: R5104; Manufacturer: YAGEO; Value: 2.2R; RK PN: RC0402JR-072R2L; Priority: A; Wattage: 1/16W; PCB Footprint: R0402; Part Type: НЁУГєсД¤µзЧи; Manufacturer PN: RC0402JR-072R2L; Created by: YTL
R5105 = RESISTOR_Dup1: НЁУГєсД¤µзЧи,2R2,+/-5%,R0402,1/16W.; Part Reference: R5105; Manufacturer: YAGEO; Value: 2.2R; RK PN: RC0402JR-072R2L; Priority: A; Wattage: 1/16W; PCB Footprint: R0402; Part Type: НЁУГєсД¤µзЧи; Manufacturer PN: RC0402JR-072R2L; Created by: YTL
R5106 = RESISTOR_Dup1: НЁУГєсД¤µзЧи,2R2,+/-5%,R0402,1/16W.; Part Reference: R5106; Manufacturer: YAGEO; Value: 2.2R; RK PN: RC0402JR-072R2L; Priority: A; Wattage: 1/16W; PCB Footprint: R0402; Part Type: НЁУГєсД¤µзЧи; Manufacturer PN: RC0402JR-072R2L; Created by: YTL
R5107 = RESISTOR_Dup1: НЁУГєсД¤µзЧи,22R,+/-5%,R0402,1/16W.; Part Reference: R5107; Manufacturer PN: RC0402JR-0722RL; Manufacturer: YAGEO; Wattage: 1/16W; Priority: A; PCB Footprint: R0402; Value: 22R; Created by: YTL; Part Type: НЁУГєсД¤µзЧи; RK PN: RC0402JR-0722RL
R5108 = RESISTOR_Dup1: НЁУГєсД¤µзЧи,2R2,+/-5%,R0402,1/16W.; Part Reference: R5108; Manufacturer: YAGEO; Value: 2.2R; RK PN: RC0402JR-072R2L; Priority: A; Wattage: 1/16W; PCB Footprint: R0402; Part Type: НЁУГєсД¤µзЧи; Manufacturer PN: RC0402JR-072R2L; Created by: YTL
R5109 = RESISTOR_Dup1: НЁУГєсД¤µзЧи,2R2,+/-5%,R0402,1/16W.; Part Reference: R5109; Manufacturer: YAGEO; Value: 2.2R; RK PN: RC0402JR-072R2L; Priority: A; Wattage: 1/16W; PCB Footprint: R0402; Part Type: НЁУГєсД¤µзЧи; Manufacturer PN: RC0402JR-072R2L; Created by: YTL
R5110 = RESISTOR_Dup1: НЁУГєсД¤µзЧи,2R2,+/-5%,R0402,1/16W.; Part Reference: R5110; Manufacturer: YAGEO; Value: 2.2R; RK PN: RC0402JR-072R2L; Priority: A; Wattage: 1/16W; PCB Footprint: R0402; Part Type: НЁУГєсД¤µзЧи; Manufacturer PN: RC0402JR-072R2L; Created by: YTL
R5111 = RESISTOR_Dup1: НЁУГєсД¤µзЧи,2R2,+/-5%,R0402,1/16W.; Part Reference: R5111; Manufacturer PN: RC0402JR-072R2L; Manufacturer: YAGEO; Value: 2.2R; Wattage: 1/16W; Priority: A; PCB Footprint: R0402; Created by: YTL; Part Type: НЁУГєсД¤µзЧи; RK PN: RC0402JR-072R2L
R5112 = RESISTOR_Dup1: НЁУГєсД¤µзЧи,22R,+/-5%,R0402,1/16W.; Part Reference: R5112; Manufacturer: YAGEO; RK PN: RC0402JR-0722RL; Priority: A; Wattage: 1/16W; PCB Footprint: R0402; Value: 22R; Part Type: НЁУГєсД¤µзЧи; Manufacturer PN: RC0402JR-0722RL; Created by: YTL
R5113 = RESISTOR_Dup1: НЁУГєсД¤µзЧи,10K5,+/-1%,R0402,1/16W.; Part Reference: R5113; Manufacturer PN: RC0402FR-0710K5L; Manufacturer: YAGEO; Value: 10.5K; Wattage: 1/16W; Priority: A; PCB Footprint: R0402; Created by: YTL; Part Type: НЁУГєсД¤µзЧи; RK PN: RC0402FR-0710K5L
R5114 = RESISTOR_Dup1: НЁУГєсД¤µзЧи,47K,+/-5%,R0402,1/16W.; Part Reference: R5114; Manufacturer: YAGEO; RK PN: RC0402JR-0747KL; Priority: A; Wattage: 1/16W; PCB Footprint: R0402; Value: 47K; Part Type: НЁУГєсД¤µзЧи; Manufacturer PN: RC0402JR-0747KL; Created by: YTL
R5115 = RESISTOR_Dup1: НЁУГєсД¤µзЧи,0R,+/-5%,R0402,1/16W.; Part Reference: R5115; Manufacturer: YAGEO; RK PN: RC0402JR-070RL; Priority: A; Wattage: 1/16W; PCB Footprint: R0402; Value: 0R; Part Type: НЁУГєсД¤µзЧи; Manufacturer PN: RC0402JR-070RL; Created by: YTL
R5116 = RESISTOR_Dup1: НЁУГєсД¤µзЧи,10K,+/-5%,R0402,1/16W.; Part Reference: R5116; Manufacturer PN: RC0402JR-0710KL; Manufacturer: YAGEO; Wattage: 1/16W; Priority: A; PCB Footprint: R0402; Value: 10K; Created by: YTL; Part Type: НЁУГєсД¤µзЧи; RK PN: RC0402JR-0710KL
R5117 = RESISTOR_Dup1: НЁУГєсД¤µзЧи,10K,+/-5%,R0402,1/16W.; Part Reference: R5117; Manufacturer: YAGEO; RK PN: RC0402JR-0710KL; Priority: A; Wattage: 1/16W; PCB Footprint: R0402; Value: 10K; Part Type: НЁУГєсД¤µзЧи; Manufacturer PN: RC0402JR-0710KL; Created by: YTL
R5118 = RESISTOR_Dup1: НЁУГєсД¤µзЧи,10K,+/-5%,R0402,1/16W.; Part Reference: R5118; Manufacturer PN: RC0402JR-0710KL; Manufacturer: YAGEO; Wattage: 1/16W; Priority: A; PCB Footprint: R0402; Value: 10K; Created by: YTL; Part Type: НЁУГєсД¤µзЧи; RK PN: RC0402JR-0710KL
R5119 = RESISTOR_Dup1: НЁУГєсД¤µзЧи,10K,+/-5%,R0402,1/16W.; Part Reference: R5119; Manufacturer PN: RC0402JR-0710KL; Manufacturer: YAGEO; Wattage: 1/16W; Priority: A; PCB Footprint: R0402; Value: 10K; Created by: YTL; Part Type: НЁУГєсД¤µзЧи; RK PN: RC0402JR-0710KL
R5120 = RESISTOR_Dup1: НЁУГєсД¤µзЧи,0R,+/-5%,R0402,1/16W.; Part Reference: R5120; Manufacturer PN: RC0402JR-070RL; Manufacturer: YAGEO; Wattage: 1/16W; Priority: A; PCB Footprint: R0402; Value: 0R; Created by: YTL; Part Type: НЁУГєсД¤µзЧи; RK PN: RC0402JR-070RL
R5121 = RESISTOR_Dup1: НЁУГєсД¤µзЧи,100K,+/-5%,R0402,1/16W.; Part Reference: R5121; Manufacturer PN: RC0402JR-07100KL; Manufacturer: YAGEO; Wattage: 1/16W; Priority: A; PCB Footprint: R0402; Value: 100K; Created by: YTL; Part Type: НЁУГєсД¤µзЧи; RK PN: RC0402JR-07100KL
R5122 = RESISTOR_Dup1: НЁУГєсД¤µзЧи,0R,+/-5%,R0402,1/16W.; Part Reference: R5122; Manufacturer: YAGEO; RK PN: RC0402JR-070RL; Priority: A; Wattage: 1/16W; PCB Footprint: R0402; Value: 0R; Part Type: НЁУГєсД¤µзЧи; Manufacturer PN: RC0402JR-070RL; Created by: YTL
R5123 = RESISTOR_Dup1: НЁУГєсД¤µзЧи,1K8,+/-5%,R0402,1/16W.; Part Reference: R5123; Manufacturer PN: RC0402JR-071K8L; Manufacturer: YAGEO; Value: 1.8K; Wattage: 1/16W; Priority: A; PCB Footprint: R0402; Created by: YTL; Part Type: НЁУГєсД¤µзЧи; RK PN: RC0402JR-071K8L
R5124 = RESISTOR_Dup1: НЁУГєсД¤µзЧи,22R,+/-5%,R0402,1/16W.; Part Reference: R5124; Manufacturer PN: RC0402JR-0722RL; Manufacturer: YAGEO; Wattage: 1/16W; Priority: A; PCB Footprint: R0402; Value: 22R; Created by: YTL; Part Type: НЁУГєсД¤µзЧи; RK PN: RC0402JR-0722RL
R5125 = RESISTOR_Dup1: НЁУГєсД¤µзЧи,1K8,+/-5%,R0402,1/16W.; Part Reference: R5125; Manufacturer PN: RC0402JR-071K8L; Manufacturer: YAGEO; Value: 1.8K; Wattage: 1/16W; Priority: A; PCB Footprint: R0402; Created by: YTL; Part Type: НЁУГєсД¤µзЧи; RK PN: RC0402JR-071K8L
R5126 = RESISTOR_Dup1: НЁУГєсД¤µзЧи,100K,+/-5%,R0402,1/16W.; Part Reference: R5126; Manufacturer PN: RC0402JR-07100KL; Manufacturer: YAGEO; Wattage: 1/16W; Priority: A; PCB Footprint: R0402; Value: 100K; Created by: YTL; Part Type: НЁУГєсД¤µзЧи; RK PN: RC0402JR-07100KL
R5127 = RESISTOR_Dup1: НЁУГєсД¤µзЧи,22R,+/-5%,R0402,1/16W.; Part Reference: R5127; Manufacturer: YAGEO; RK PN: RC0402JR-0722RL; Priority: A; Wattage: 1/16W; PCB Footprint: R0402; Value: 22R; Part Type: НЁУГєсД¤µзЧи; Manufacturer PN: RC0402JR-0722RL; Created by: YTL
R5128 = RESISTOR_Dup1: НЁУГєсД¤µзЧи,10K,+/-5%,R0402,1/16W.; Part Reference: R5128; Manufacturer PN: RC0402JR-0710KL; Manufacturer: YAGEO; Wattage: 1/16W; Priority: A; PCB Footprint: R0402; Value: 10K; Created by: YTL; Part Type: НЁУГєсД¤µзЧи; RK PN: RC0402JR-0710KL
R5129 = RESISTOR_Dup1: НЁУГєсД¤µзЧи,10K,+/-5%,R0402,1/16W.; Part Reference: R5129; Manufacturer PN: RC0402JR-0710KL; Manufacturer: YAGEO; Wattage: 1/16W; Priority: A; PCB Footprint: R0402; Value: 10K; Created by: YTL; Part Type: НЁУГєсД¤µзЧи; RK PN: RC0402JR-0710KL
R5130 = RESISTOR_Dup1: НЁУГєсД¤µзЧи,51K,+/-5%,R0402,1/16W.; Part Reference: R5130; Manufacturer PN: RC0402JR-0751KL; Manufacturer: YAGEO; Wattage: 1/16W; Priority: A; PCB Footprint: R0402; Value: 51K; Created by: YTL; Part Type: НЁУГєсД¤µзЧи; RK PN: RC0402JR-0751KL
R5131 = RESISTOR_Dup1: НЁУГєсД¤µзЧи,10K,+/-5%,R0402,1/16W.; Part Reference: R5131; Manufacturer: YAGEO; RK PN: RC0402JR-0710KL; Priority: A; Wattage: 1/16W; PCB Footprint: R0402; Value: 10K; Part Type: НЁУГєсД¤µзЧи; Manufacturer PN: RC0402JR-0710KL; Created by: YTL
R5132 = RESISTOR_Dup1: НЁУГєсД¤µзЧи,100K,+/-1%,R0402,1/16W.; Part Reference: R5132; Manufacturer: YAGEO; RK PN: RC0402FR-07100KL; Priority: A; Wattage: 1/16W; PCB Footprint: R0402; Value: 100K; Part Type: НЁУГєсД¤µзЧи; Manufacturer PN: RC0402FR-07100KL; Created by: YTL
R5133 = RESISTOR_Dup1: НЁУГєсД¤µзЧи,150K,+/-1%,R0402,1/16W.; Part Reference: R5133; Manufacturer: YAGEO; RK PN: RC0402FR-07150KL; Priority: A; Wattage: 1/16W; PCB Footprint: R0402; Value: 150K; Part Type: НЁУГєсД¤µзЧи; Manufacturer PN: RC0402FR-07150KL; Created by: YTL
R5135 = RESISTOR_Dup1: НЁУГєсД¤µзЧи,470K,+/-5%,R0402,1/16W.; Part Reference: R5135; Manufacturer PN: RC0402JR-07470KL; Manufacturer: YAGEO; Wattage: 1/16W; Priority: A; PCB Footprint: R0402; Value: 470K; Created by: YTL; Part Type: НЁУГєсД¤µзЧи; RK PN: RC0402JR-07470KL
R5136 = RESISTOR_Dup1: НЁУГєсД¤µзЧи,10K,+/-5%,R0402,1/16W.; Part Reference: R5136; Manufacturer PN: RC0402JR-0710KL; Manufacturer: YAGEO; Wattage: 1/16W; Priority: A; PCB Footprint: R0402; Value: 10K; Created by: YTL; Part Type: НЁУГєсД¤µзЧи; RK PN: RC0402JR-0710KL
R5137 = RESISTOR_Dup1: НЁУГєсД¤µзЧи,1K2,+/-5%,R0402,1/16W.; Part Reference: R5137; Manufacturer: YAGEO; Value: 1.2K; RK PN: RC0402JR-071K2L; Priority: A; Wattage: 1/16W; PCB Footprint: R0402; Part Type: НЁУГєсД¤µзЧи; Manufacturer PN: RC0402JR-071K2L; Created by: YTL
R5138 = RESISTOR_Dup1: НЁУГєсД¤µзЧи,0R,+/-5%,R0402,1/16W.; Part Reference: R5138; Manufacturer: YAGEO; RK PN: RC0402JR-070RL; Priority: A; Wattage: 1/16W; PCB Footprint: R0402; Value: 0R; Part Type: НЁУГєсД¤µзЧи; Manufacturer PN: RC0402JR-070RL; Created by: YTL
R5139 = RESISTOR_Dup1: НЁУГєсД¤µзЧи,10K,+/-5%,R0402,1/16W.; Part Reference: R5139; Manufacturer PN: RC0402JR-0710KL; Manufacturer: YAGEO; Wattage: 1/16W; Priority: A; PCB Footprint: R0402; Value: 10K; Created by: YTL; Part Type: НЁУГєсД¤µзЧи; RK PN: RC0402JR-0710KL
TP5100 = TP: Test Point 0.7mm; Part Reference: TP5100; PCB Footprint: TP_0R70; Value: TP_0.7; RK PN: TESTPOINT_0R7; Priority: A; Part Type: TP; Created by: JJJ
TP5101 = TP: Test Point 0.7mm; Part Reference: TP5101; PCB Footprint: TP_0R70; Value: TP_0.7; RK PN: TESTPOINT_0R7; Priority: A; Part Type: TP; Created by: JJJ
TP5102 = TP: Test Point 0.7mm; Part Reference: TP5102; PCB Footprint: TP_0R70; Value: TP_0.7; RK PN: TESTPOINT_0R7; Priority: A; Part Type: TP; Created by: JJJ
U5100 = IT6563FN: Part Reference: U5100; Value: IT6563FN
U5101 = DCDC_SY8088: High Efficiency 5.5V, 2A continuous, 3A peak, 1MHz Synchronous Step Down Regulator; Part Reference: U5101; Manufacturer PN: SY8089AAC; Manufacturer: SilergyЈЁОщБ¦ЅЬЈ©; Value: ETA3409/SY8089AAC; Priority: A; PCB Footprint: SOT_23_5; Created by: JJJ; Part Type: DCDC; RK PN: SY8089AAC
Y5100 = CRYSTAL_4P: ОЮФґѕ§ХсЈ¬27MЈ¬3225,ЎА10ppmЈ¬10pFЈ¬Hosonic; Part Reference: Y5100; Manufacturer: Hosonic(єиРЗµзЧУ); Value: 27MHz; RK PN: E3SB27.0000F10E11; Priority: A; Part Type: CRYSTAL; Manufacturer PN: E3SB27.0000F10E11; Created by: JJJ